# EAGLE schematic Lights_Horn (EAGLE 8.3.2)
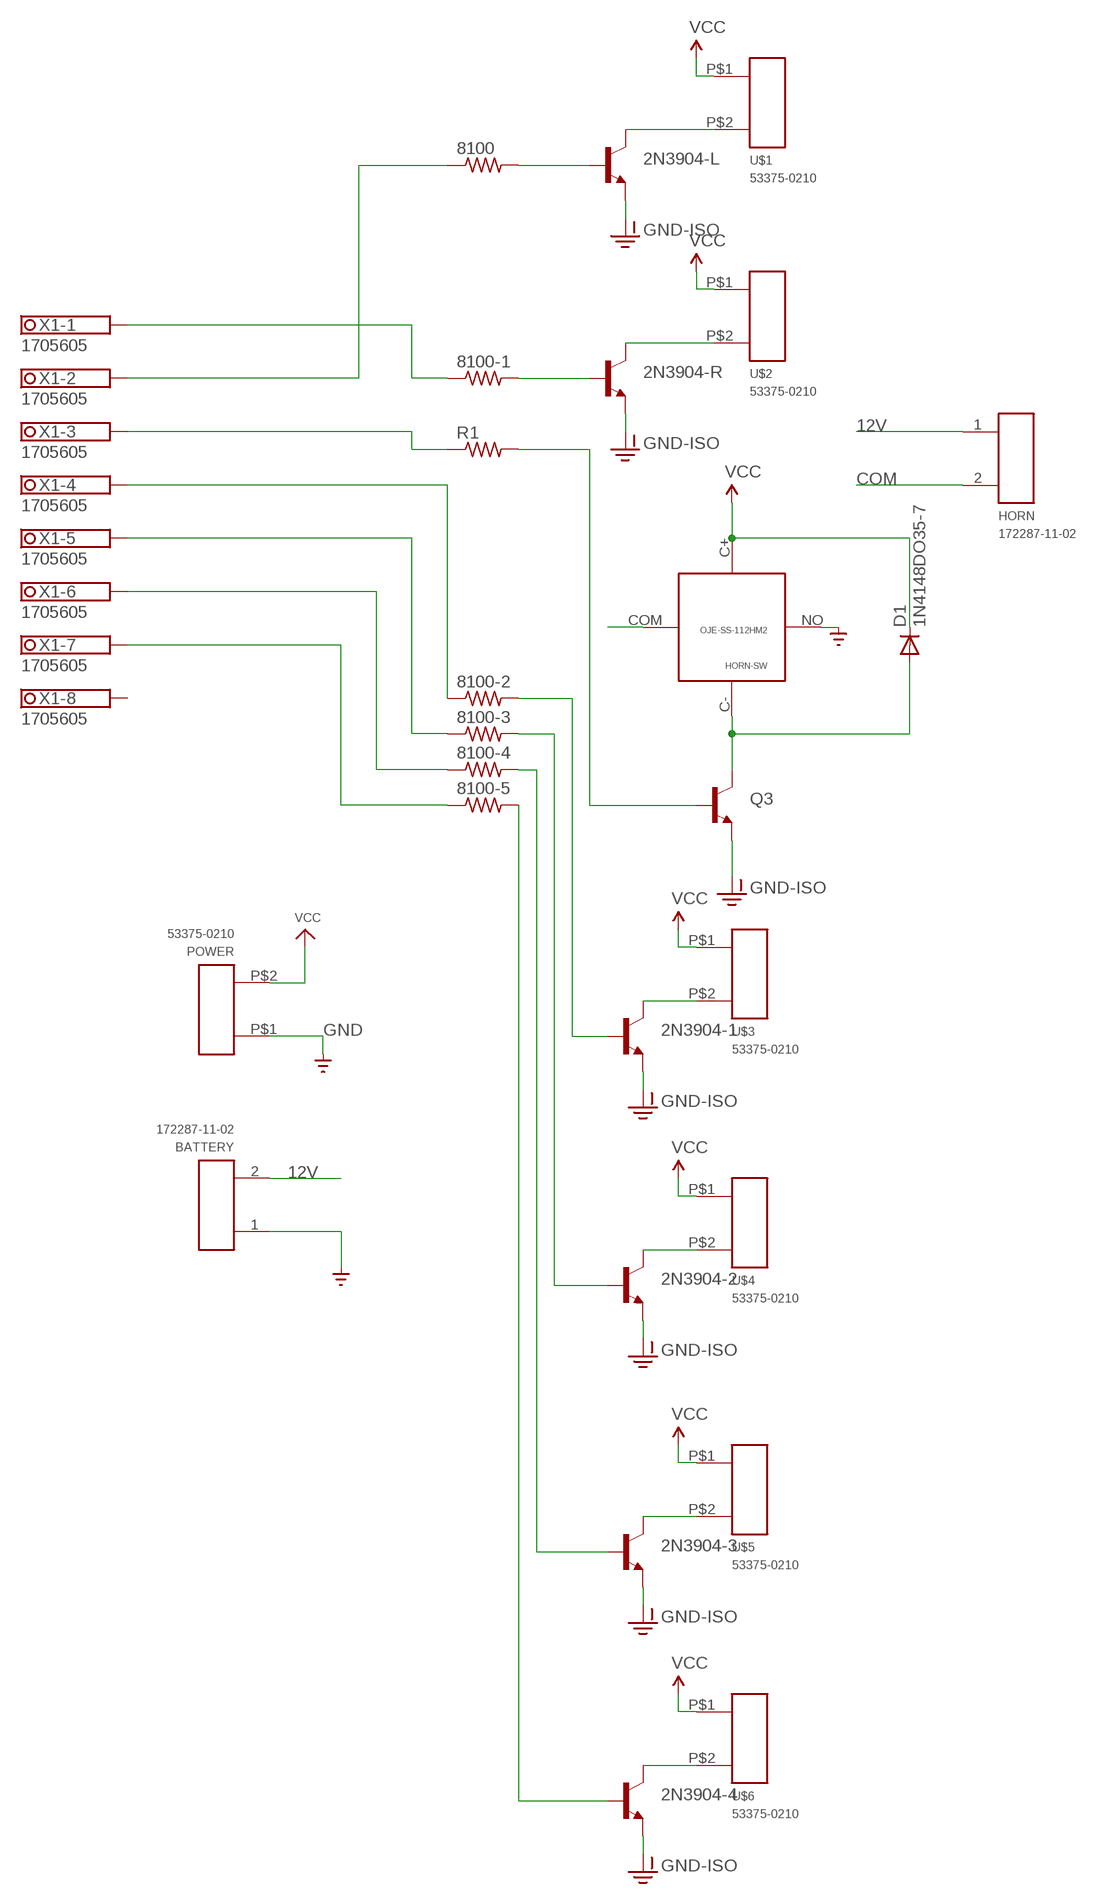
[diagram p0: schematic, sheet 1]

## Parts
2N3904-1  TRANSISTOR_NPN2N3904  [TO-92]
2N3904-2  TRANSISTOR_NPN2N3904  [TO-92]
2N3904-3  TRANSISTOR_NPN2N3904  [TO-92]
2N3904-4  TRANSISTOR_NPN2N3904  [TO-92]
2N3904-L  TRANSISTOR_NPN2N3904  [TO-92]
2N3904-R  TRANSISTOR_NPN2N3904  [TO-92]
8100  R-US_0204/2V  [0204V]
8100-1  R-US_0204/2V  [0204V]
8100-2  R-US_0204/2V  [0204V]
8100-3  R-US_0204/2V  [0204V]
8100-4  R-US_0204/2V  [0204V]
8100-5  R-US_0204/2V  [0204V]
BATTERY  172287-11-02  [172287-ULTRA-FIT]
D1  1N4148DO35-7  [DO35-7]
HORN  172287-11-02  [172287-ULTRA-FIT]
HORN-SW  OJE-SS-112HM2  [OJE-SS-112HM2-SPST-RELAY]
POWER  53375-0210  [53375-0210-MINI-LOCK]
Q3  TRANSISTOR_NPN2N3904  [TO-92]
R1  R-US_0204/2V  [0204V]
U$1  53375-0210  [53375-0210-MINI-LOCK]
U$2  53375-0210  [53375-0210-MINI-LOCK]
U$3  53375-0210  [53375-0210-MINI-LOCK]
U$4  53375-0210  [53375-0210-MINI-LOCK]
U$5  53375-0210  [53375-0210-MINI-LOCK]
U$6  53375-0210  [53375-0210-MINI-LOCK]
X1  1705605  [1705605]

## Nets
12V: BATTERY.2 HORN.1
COM: HORN-SW.COM HORN.2
GND: BATTERY.1 HORN-SW.NO POWER.P$1 ; supply symbol labelled GND_
GND-ISO: 2N3904-1.1(E) 2N3904-2.1(E) 2N3904-3.1(E) 2N3904-4.1(E) 2N3904-L.1(E) 2N3904-R.1(E) Q3.1(E)
N$1: 8100-1.1 X1.1.1 X1.1.2
N$2: 8100.1 X1.2.1 X1.2.2
N$3: 2N3904-L.2(B) 8100.2
N$4: 2N3904-R.2(B) 8100-1.2
N$5: 2N3904-L.3(C) U$1.P$2
N$6: 2N3904-R.3(C) U$2.P$2
N$7: 8100-2.1 X1.4.1 X1.4.2
N$8: Q3.2(B) R1.2
N$9: D1.A HORN-SW.C- Q3.3(C)
N$10: R1.1 X1.3.1 X1.3.2
N$11: 8100-3.1 X1.5.1 X1.5.2
N$12: 2N3904-1.2(B) 8100-2.2
N$13: 2N3904-1.3(C) U$3.P$2
N$14: 2N3904-2.2(B) 8100-3.2
N$15: 2N3904-2.3(C) U$4.P$2
N$16: 2N3904-3.2(B) 8100-4.2
N$17: 2N3904-3.3(C) U$5.P$2
N$18: 2N3904-4.2(B) 8100-5.2
N$19: 2N3904-4.3(C) U$6.P$2
N$20: 8100-4.1 X1.6.1 X1.6.2
N$21: 8100-5.1 X1.7.1 X1.7.2
VCC: D1.C HORN-SW.C+ POWER.P$2 U$1.P$1 U$2.P$1 U$3.P$1 U$4.P$1 U$5.P$1 U$6.P$1
Unconnected: X1.8.1 X1.8.2

## Library data of the parts
2N3904-1 = SparkFun-DiscreteSemi:TRANSISTOR_NPN: Generic NPN BJT MMBT2222A - TRANS-08049 (SOT-23, 1A 40V) MPSA42 - TRANS-09116 (SOT-23, 500mA 300V) MMBT5088LT1G - TRANS-11160 (SOT-23, 50 mA 30V) BC547 - COM-08928 <http://www.sparkfun.com/products/8928> (TO-92 45V 100mA) (1.Collector 2.Base 3.Emitter) 2N3904 - COM-00521 <http://www.sparkfun.com/products/521> (TO-92 40V 200mA) (1.Emitter 2.Base 3.Collector) P2N2222A - COM-12852 <http://www.sparkfun.com/products/12852> (TO-92 40V 600mA) (1.Collector 2.Base 3.Emitter); PROD_ID: 2N3904-1
2N3904-2-2N3904-4 2N3904-L 2N3904-R Q3 = SparkFun-DiscreteSemi:TRANSISTOR_NPN: Generic NPN BJT MMBT2222A - TRANS-08049 (SOT-23, 1A 40V) MPSA42 - TRANS-09116 (SOT-23, 500mA 300V) MMBT5088LT1G - TRANS-11160 (SOT-23, 50 mA 30V) BC547 - COM-08928 <http://www.sparkfun.com/products/8928> (TO-92 45V 100mA) (1.Collector 2.Base 3.Emitter) 2N3904 - COM-00521 <http://www.sparkfun.com/products/521> (TO-92 40V 200mA) (1.Emitter 2.Base 3.Collector) P2N2222A - COM-12852 <http://www.sparkfun.com/products/12852> (TO-92 40V 600mA) (1.Collector 2.Base 3.Emitter); PROD_ID: TRANS-08447
8100 8100-1-8100-5 R1 = rcl:R-US_: RESISTOR, American symbol; 8100: 8100
BATTERY HORN = Hooman:172287-11-02: Ultra-Fit™ 172287 Header Molex 3.5 mm pitch 2 pin connector header
D1 = diode:1N4148: DIODE high speed (Philips)
HORN-SW = Hooman:OJE-SS-112HM2: TE SPST RELAY
POWER U$1-U$6 = Hooman:53375-0210: Mini-Lock Header 2 pin 53375 series
X1 = con-phoenix-3.81:1705605: MKDSD 1,5/10-3,81 Printklemme Nennstrom: 8 A Bemessungsspannung: 200 V Raster: 3,81 mm Polzahl: 12 Montageart: Löten Anschlussart: Schraubanschluss Anschlussrichtung vom Leiter zur Platine: 0° Source: http://eshop.phoenixcontact.com .. 1705605.pdf; OC_FARNELL: unknown; OC_NEWARK: unknown